# Altium schematic sheet ASBB_SX1278.SchDoc
size A4
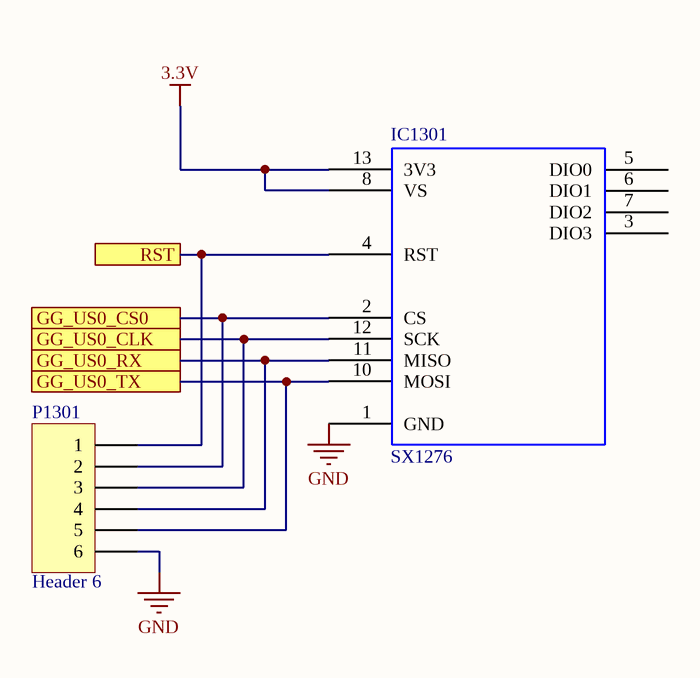
[diagram p0: ASBB_SX1278.SchDoc]

## Parts
IC1301  SX1276  [Modtronix inAir9]
P1301  Header 6  [HDR1X6]

## Ports
GG_US0_CLK, GG_US0_CS0, GG_US0_RX, GG_US0_TX, RST

## Nets
3.3V: IC1301.8(VS) IC1301.13(3V3)
GND: IC1301.1(GND) P1301.6
GG_US0_CLK: IC1301.12(SCK) P1301.3 ; port GG_US0_CLK
GG_US0_CS0: IC1301.2(CS) P1301.2 ; port GG_US0_CS0
GG_US0_RX: IC1301.11(MISO) P1301.4 ; port GG_US0_RX
GG_US0_TX: IC1301.10(MOSI) P1301.5 ; port GG_US0_TX
RST: IC1301.4(RST) P1301.1 ; port RST

Not connected (* = marked no-connect by the designer): IC1301 3(DIO3) 5(DIO0) 6(DIO1) 7(DIO2) 9(NC) 14(NC)

## Library data of the parts
IC1301 = Modtronix inAir9: Modtronix LoRa Transceiver
P1301 = Header 6: Header, 6-Pin; LatestRevisionDate: 17-Jul-2002; LatestRevisionNote: Re-released for DXP Platform.; Publisher: Altium Limited